# EasyEDA schematic SCH_OSHW_BiDi_SDI_Fiber_Converter_V4_Reclocker_2024-11-17.json

## Sheets
1 SFP: TITLE: Sheet_1; REV: 1.0; Date: 2024-08-29; Sheet: 1/1; Drawn By: TheStaticTurtle; Company: Your Company
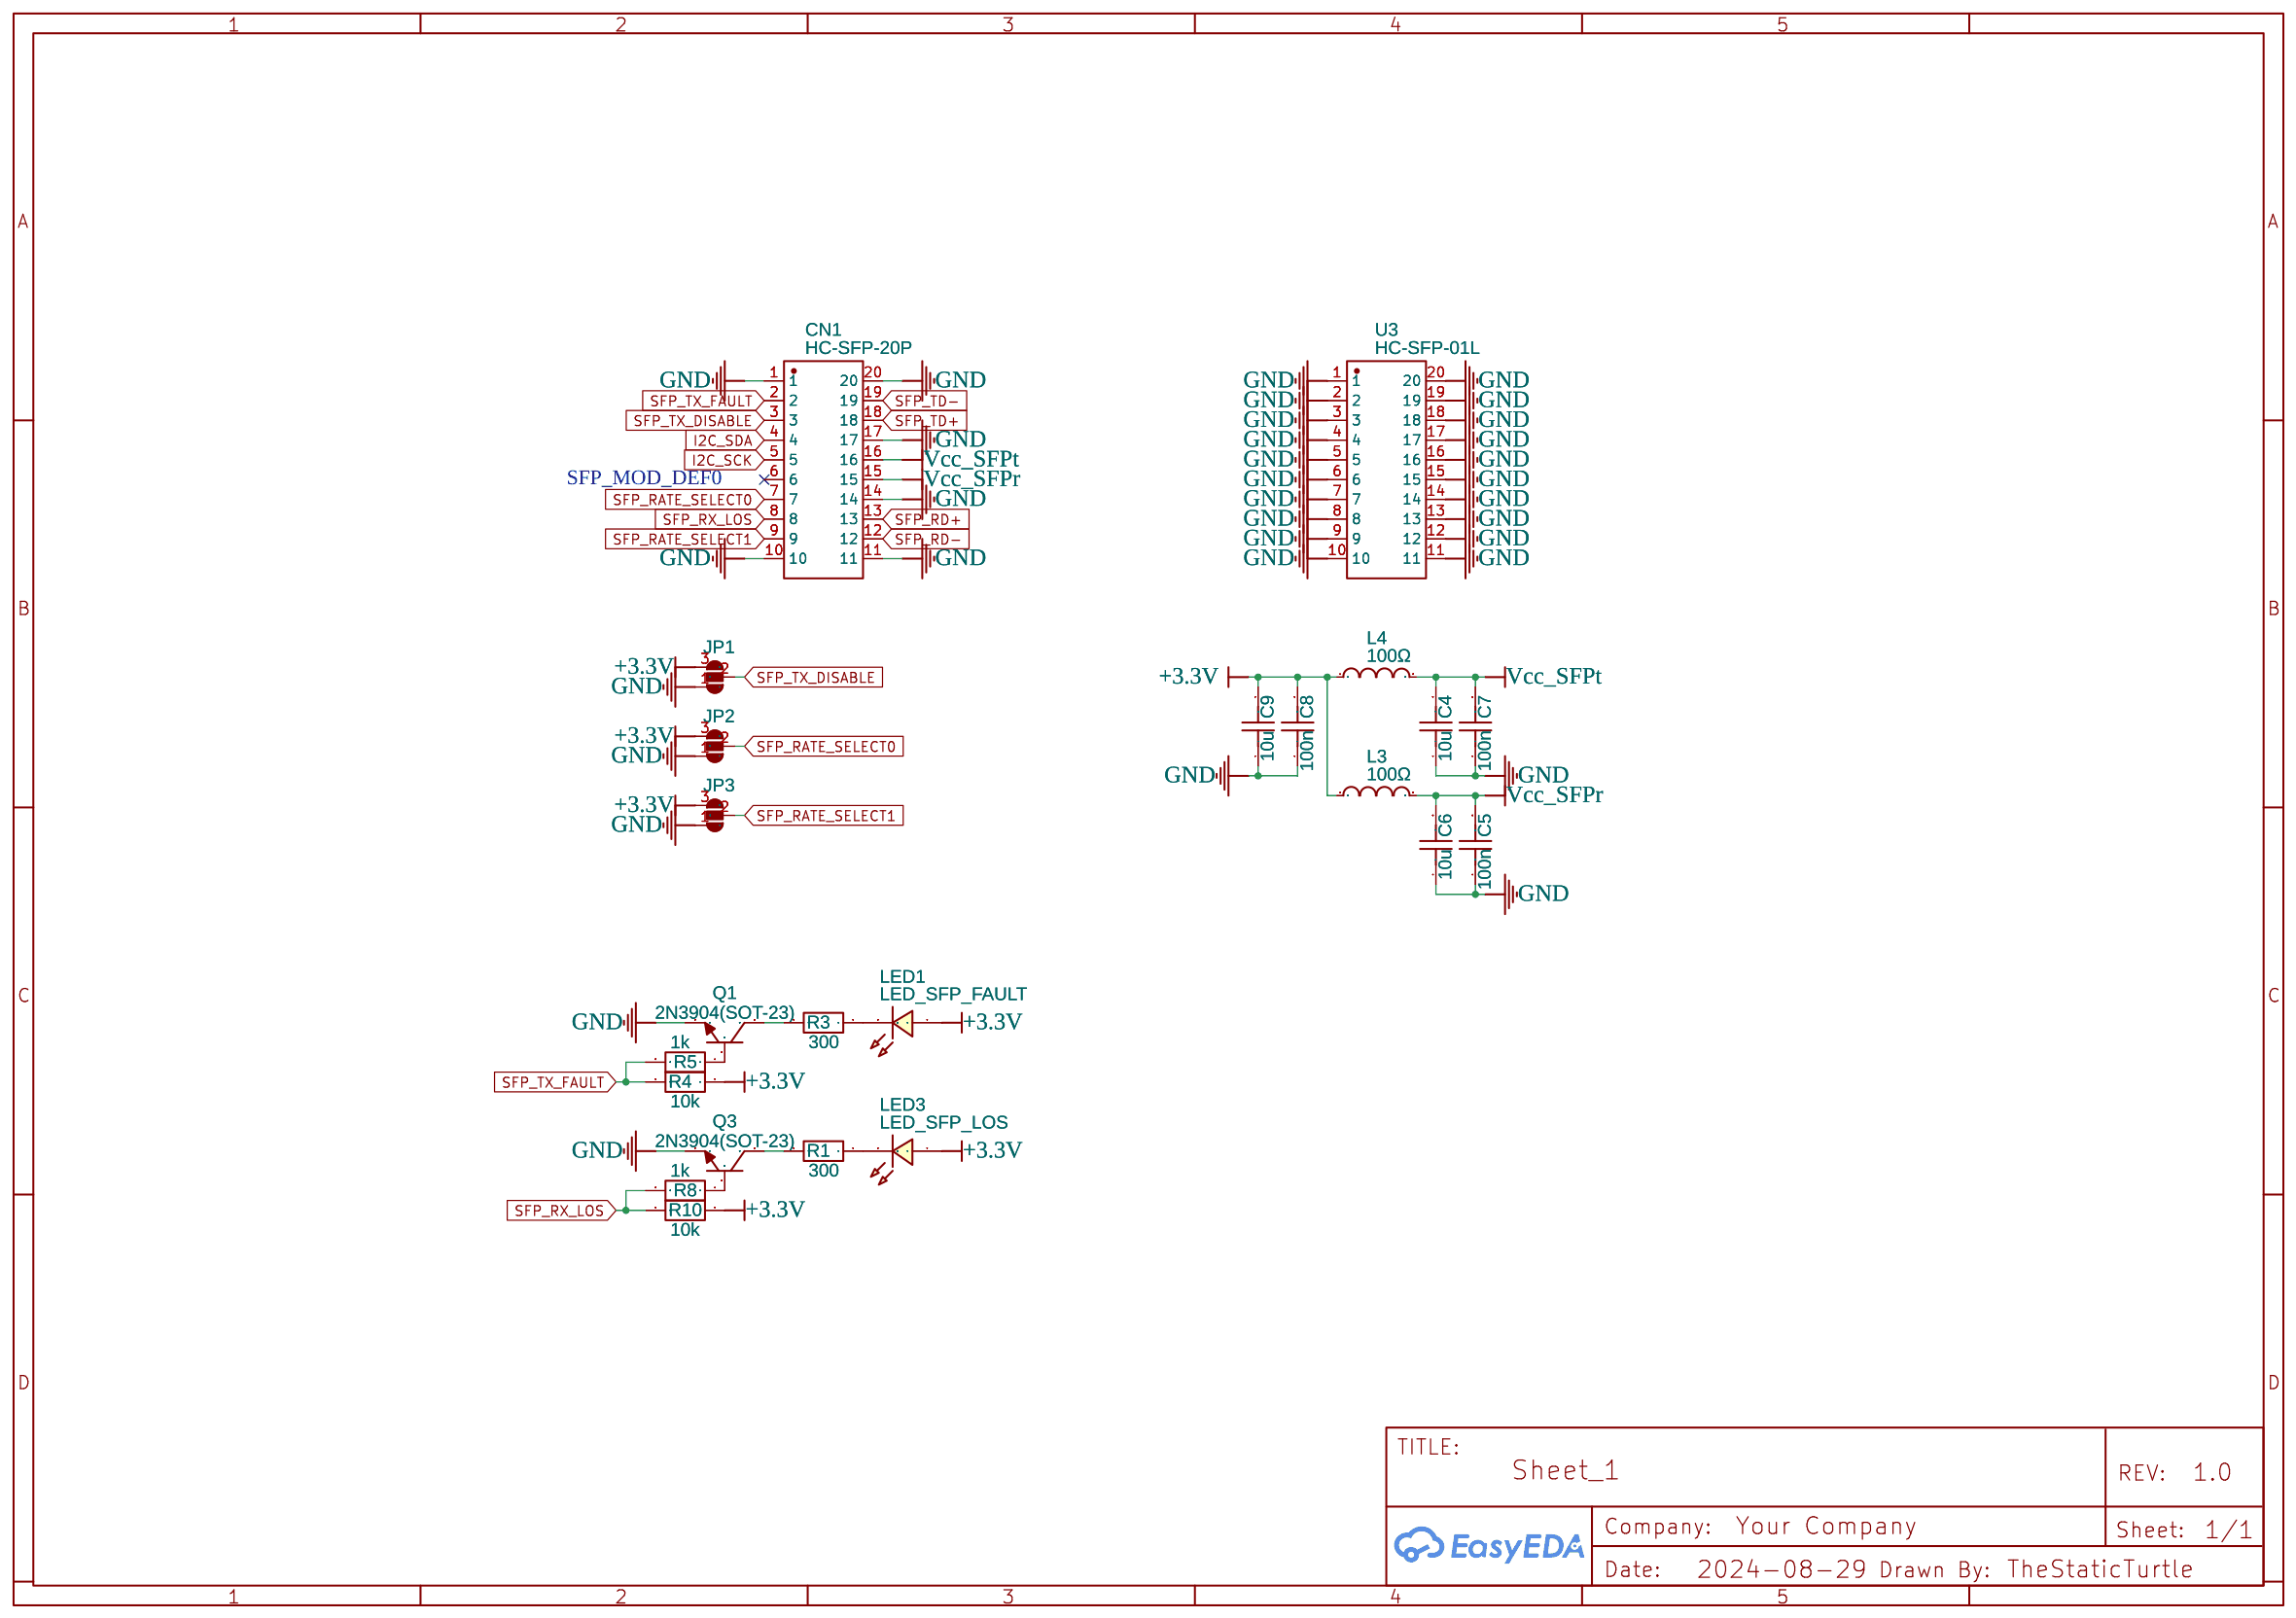
[diagram p0: SFP]
2 Power
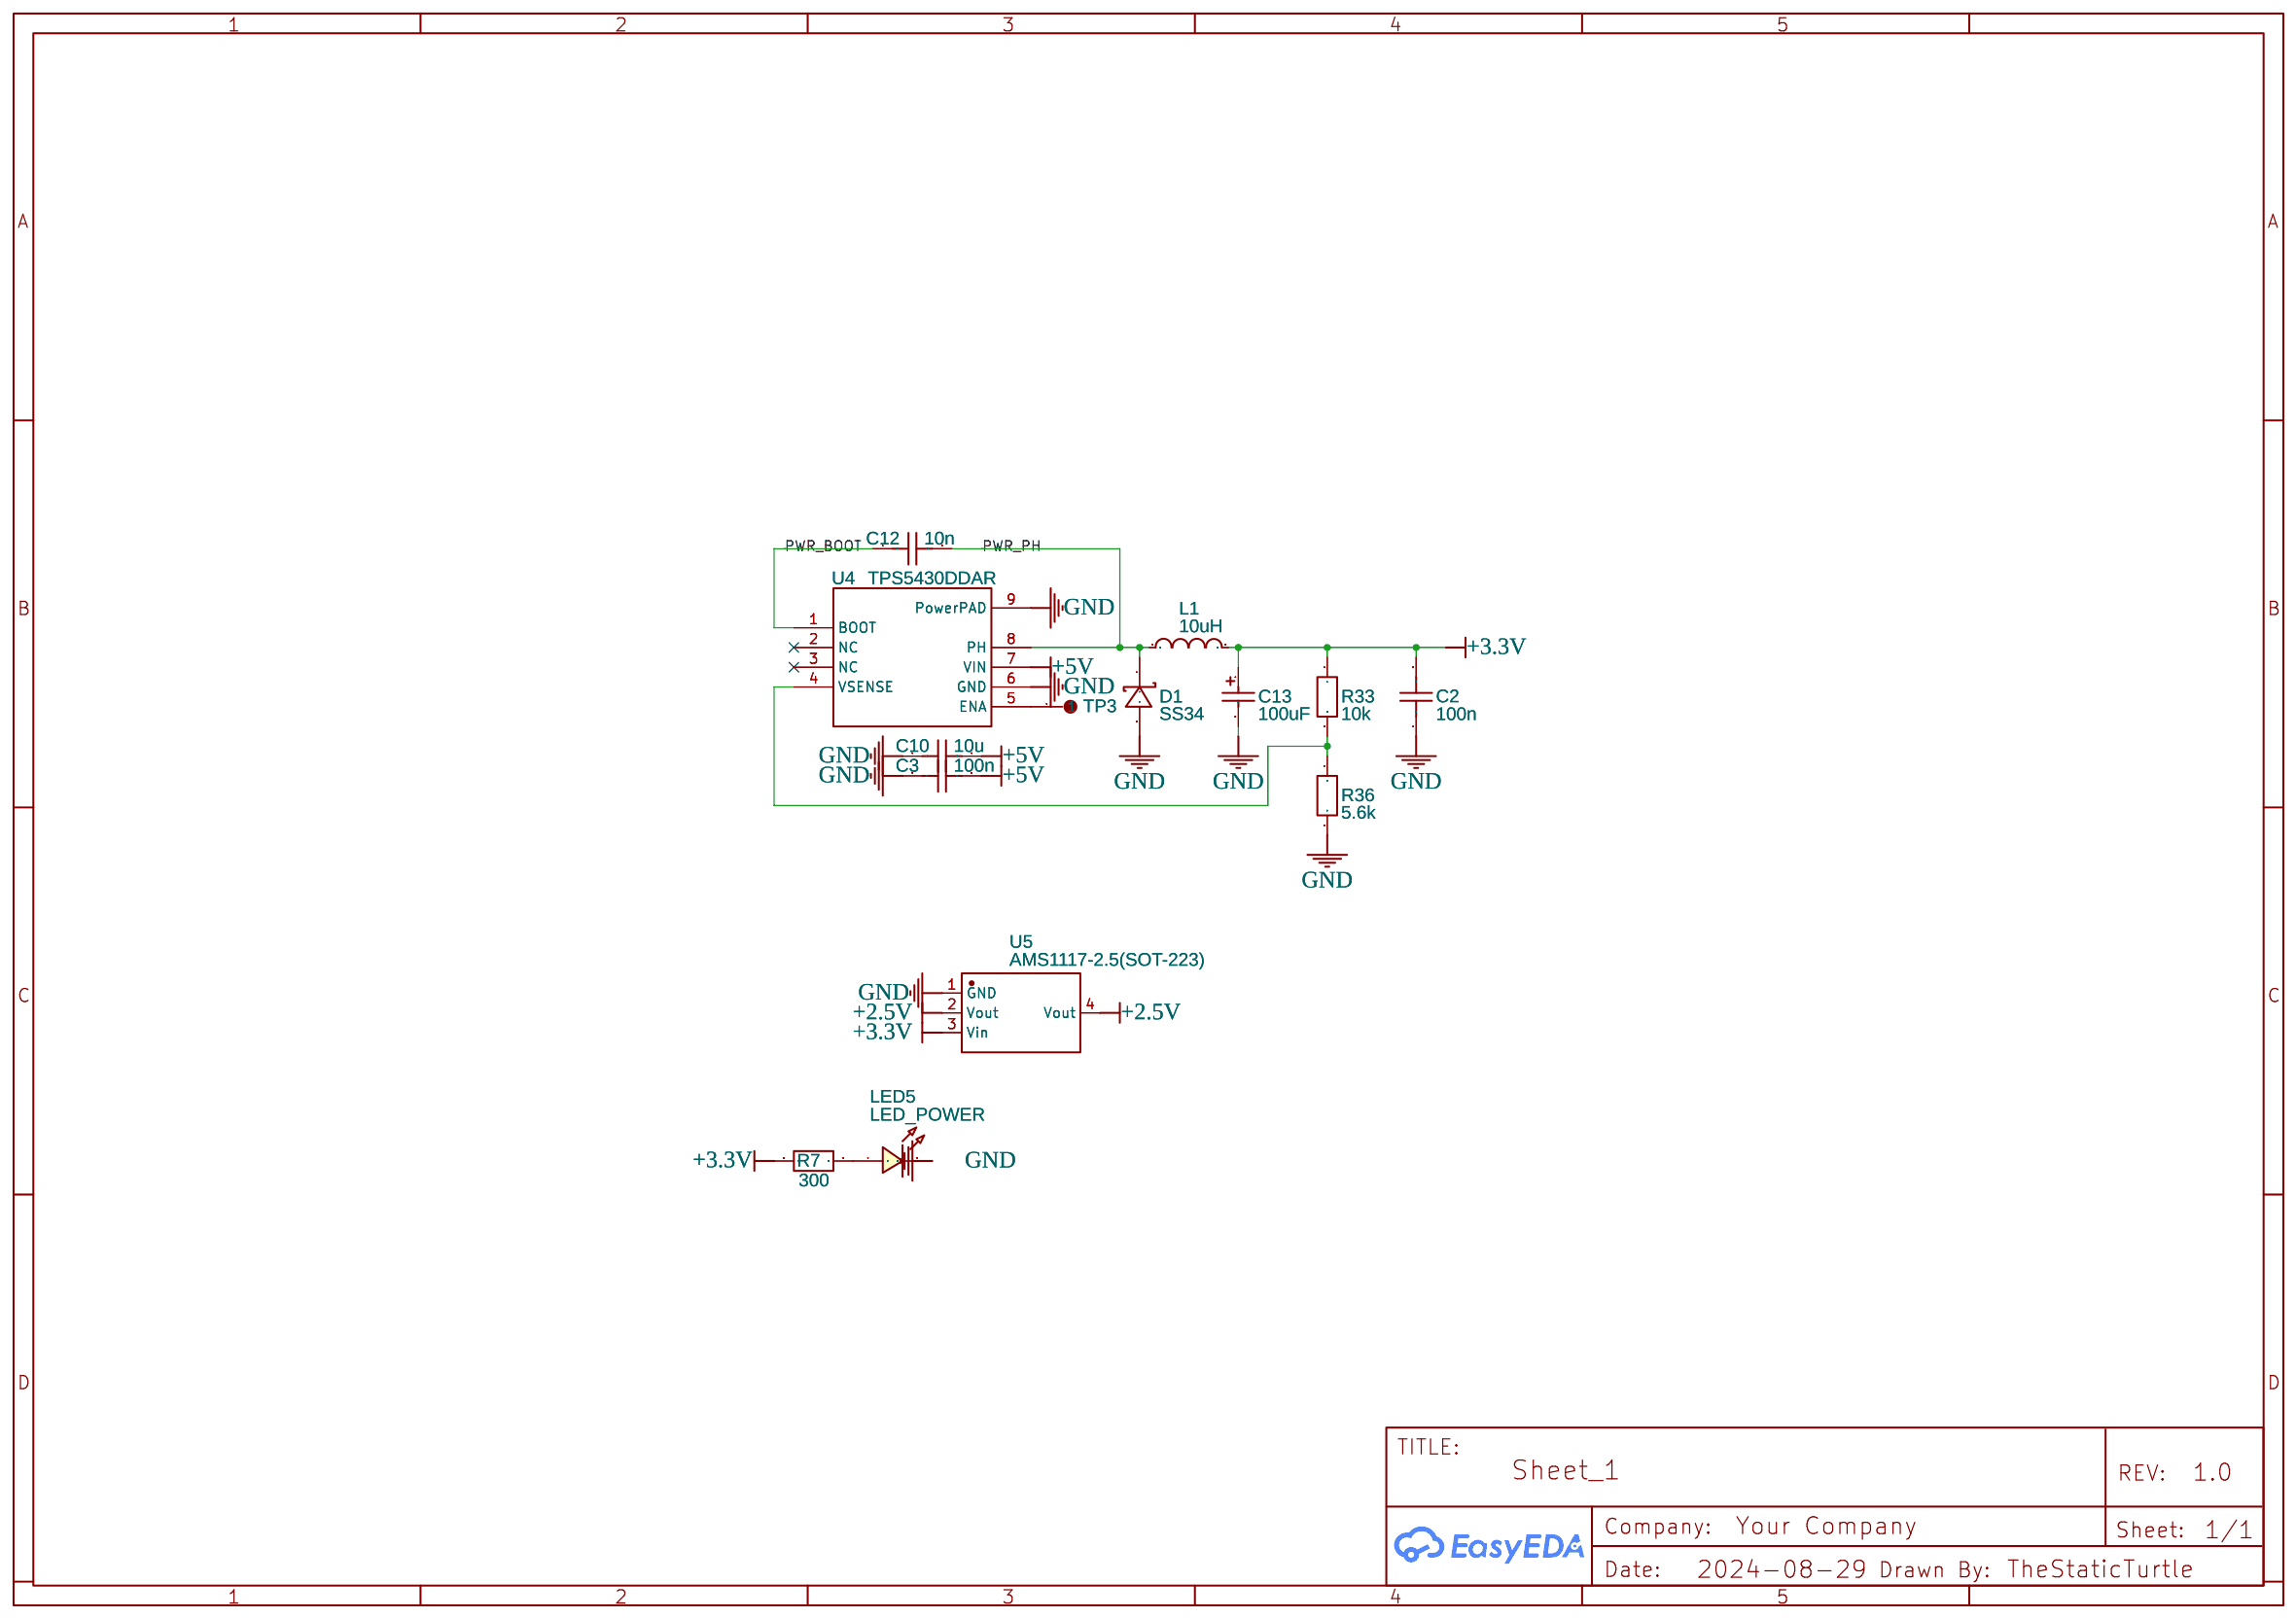
[diagram p1: Power]
3 SDI
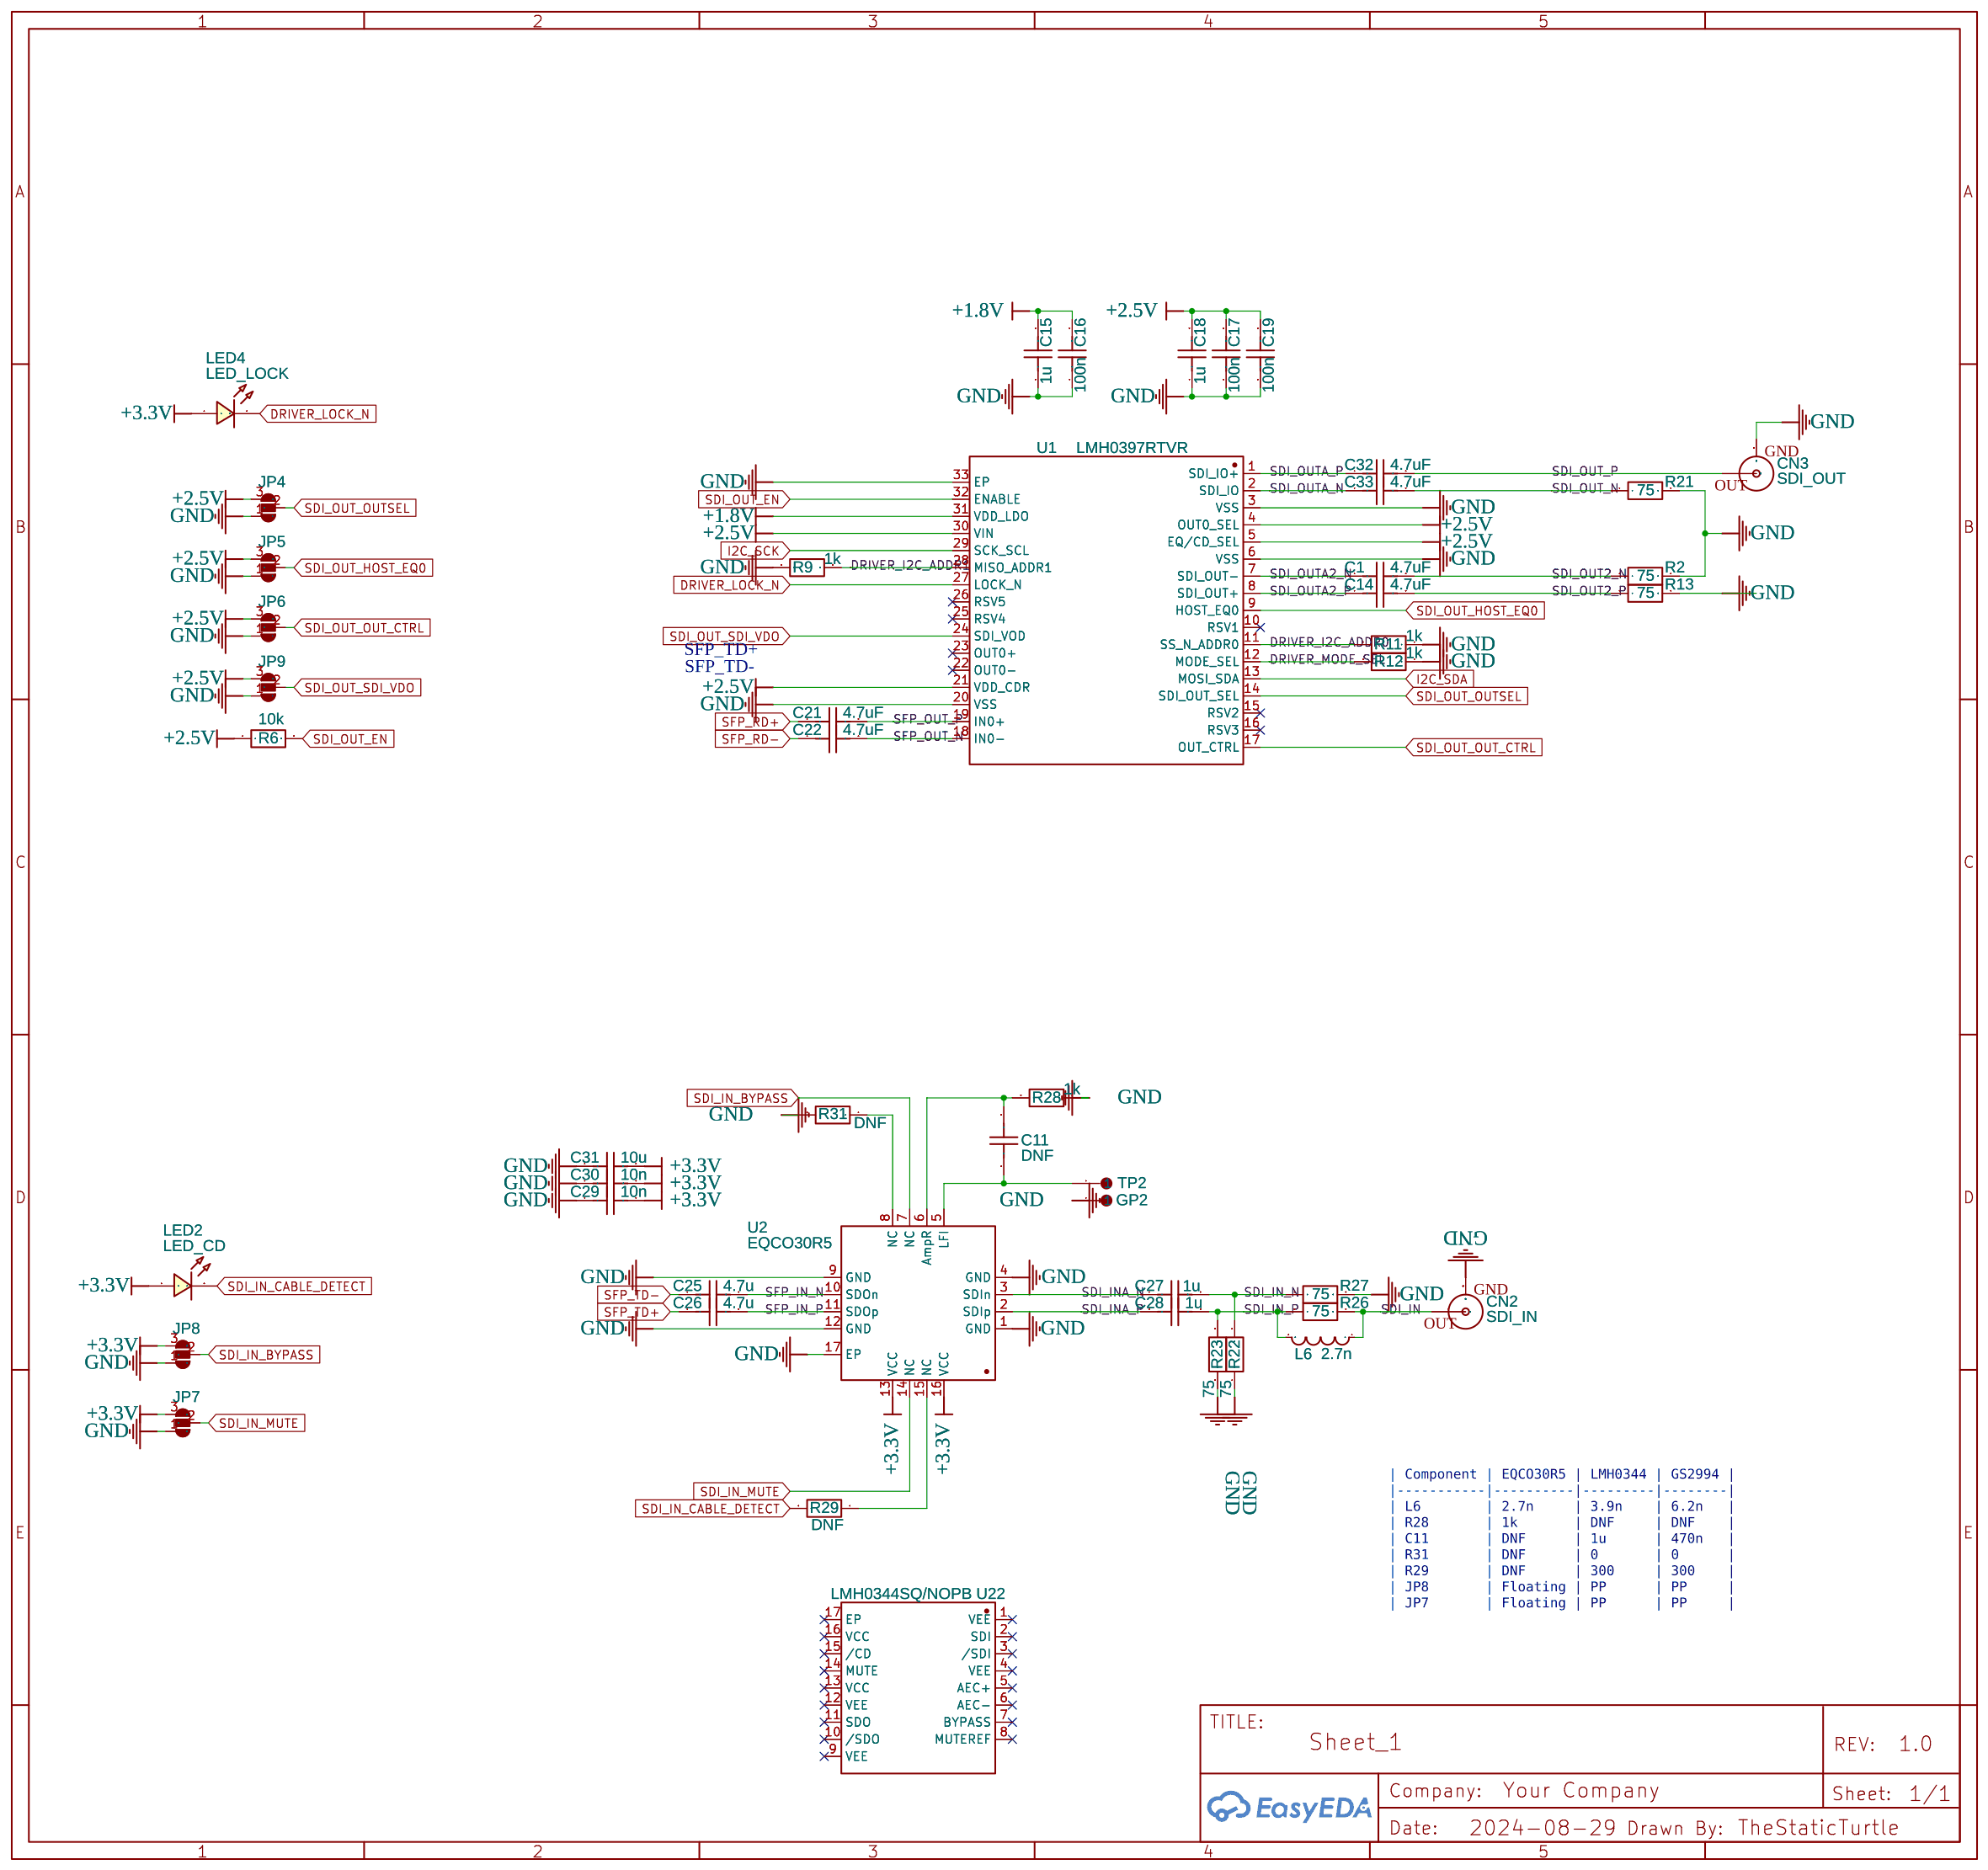
[diagram p2: SDI]
4 Diag: Date: 2024-09-08
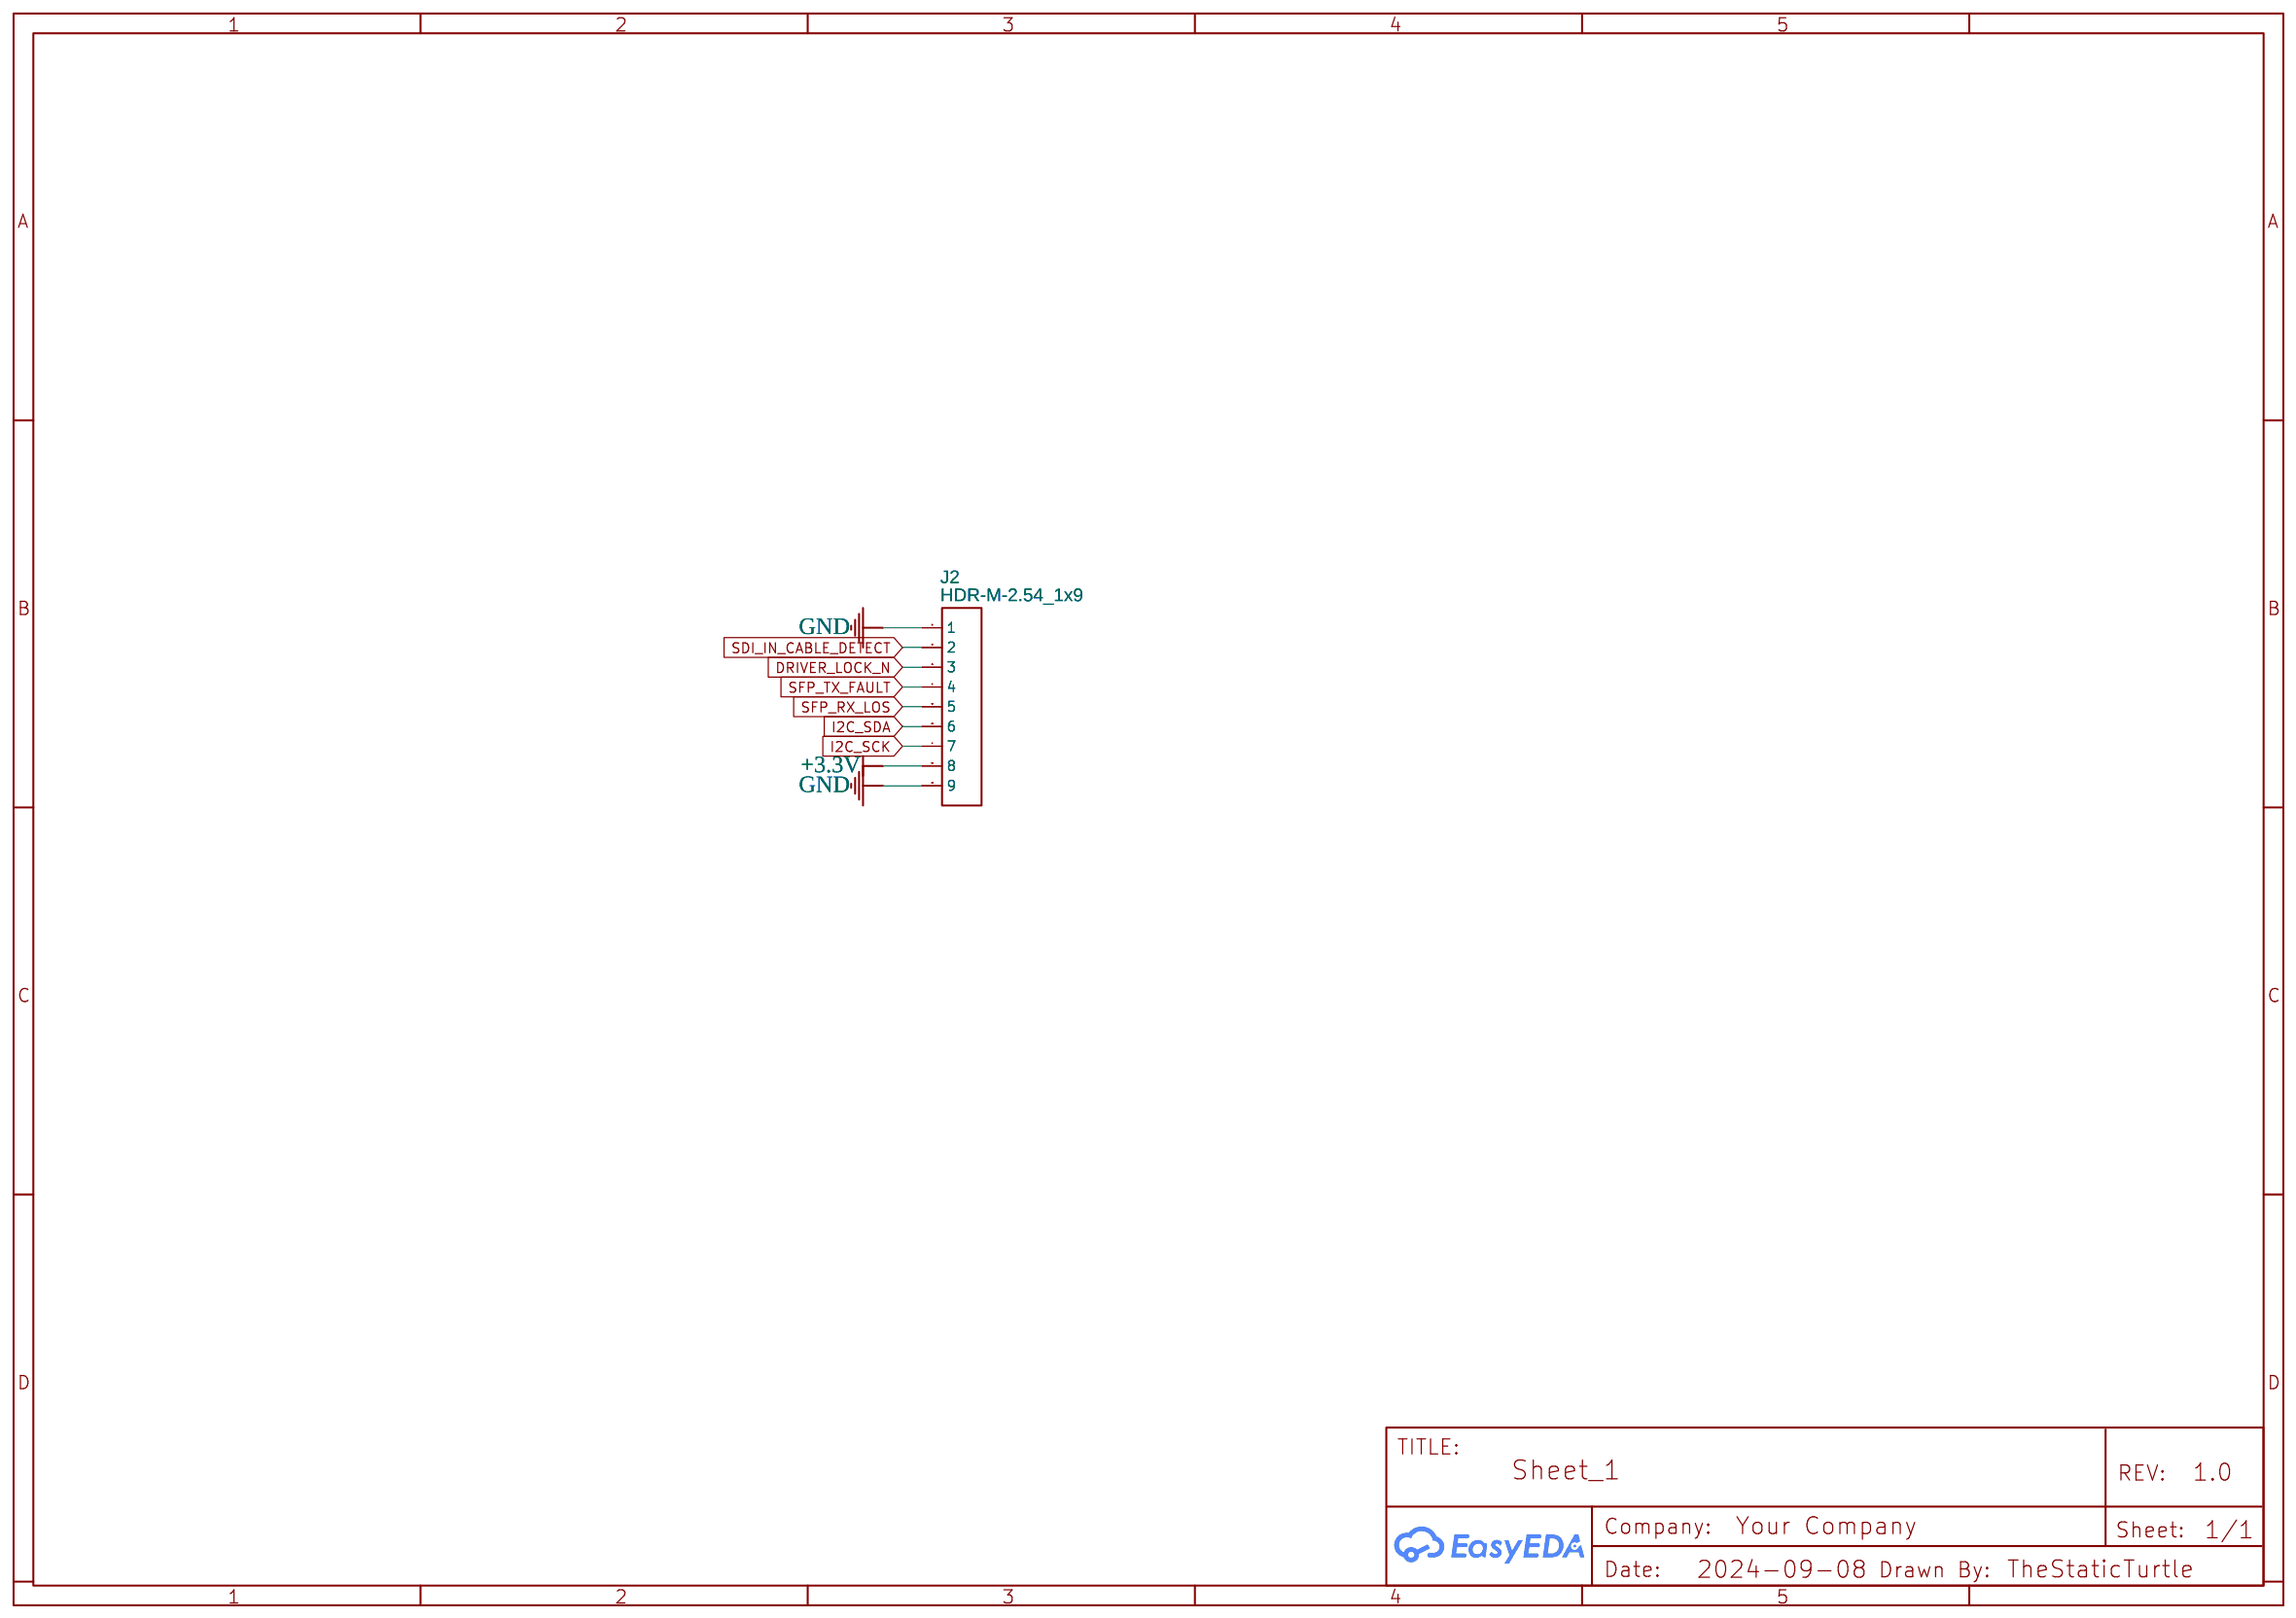
[diagram p3: Diag]

## Parts
sheet Diag
J2  HDR-M-2.54_1x9  [HDR-M-2.54_1X9]
sheet Power
C2  100n  [C0603]
C3  100n  [C0603]
C10  10u  [C0603]
C12  10n  [C0603]
C13  100uF  [CASE-B_3528]
D1  SS34  [SMA_L4.3-W2.6-LS5.2-RD]
L1  10uH  [IND-SMD_L4.0-W4.0]
LED5  LED_POWER  [LED0805_BLUE]
R7  300  [R0603]
R33  10k  [R0603]
R36  5.6k  [R0603]
TP3  TEST-POINT-PTH-1X1  [TESTPOINT-SMD_L1.6-W0.8_RCU-0C]
U4  TPS5430DDAR  [ESOP-8_L4.9-W3.9-P1.27-LS6.0-TL-EP]
U5  AMS1117-2.5(SOT-223)  [SOT-223-4_L6.5-W3.5-P2.30-LS7.0-BR]
sheet SDI
C1  4.7uF  [C0603]
C11  DNF  [C0603]
C14  4.7uF  [C0603]
C15  1u  [C0603]
C16  100n  [C0603]
C17  100n  [C0603]
C18  1u  [C0603]
C19  100n  [C0603]
C21  4.7uF  [C0603]
C22  4.7uF  [C0603]
C25  4.7u  [C0603]
C26  4.7u  [C0603]
C27  1u  [C0603]
C28  1u  [C0603]
C29  10n  [C0603]
C30  10n  [C0603]
C31  10u  [C0603]
C32  4.7uF  [C0603]
C33  4.7uF  [C0603]
CN2  SDI_IN  [AMPHENOLRF_034-1030-12G]
CN3  SDI_OUT  [AMPHENOLRF_034-1030-12G]
GP2  TEST-POINT-PTH-1X1  [TESTPOINT-SMD_L1.6-W0.8_RCU-0C]
JP4  SOLDER BRIDGE 3P  [SOLDER BRIDGE 3P]
JP5  SOLDER BRIDGE 3P  [SOLDER BRIDGE 3P]
JP6  SOLDER BRIDGE 3P  [SOLDER BRIDGE 3P]
JP7  SOLDER BRIDGE 3P  [SOLDER BRIDGE 3P]
JP8  SOLDER BRIDGE 3P  [SOLDER BRIDGE 3P]
JP9  SOLDER BRIDGE 3P  [SOLDER BRIDGE 3P]
L6  2.7n  [L0603]
LED2  LED_CD  [LED0805_GREEN]
LED4  LED_LOCK  [LED0805_GREEN]
R2  75  [R0603]
R6  10k  [R0603]
R9  1k  [R0603]
R11  1k  [R0603]
R12  1k  [R0603]
R13  75  [R0603]
R21  75  [R0603]
R22  75  [R0603]
R23  75  [R0603]
R26  75  [R0603]
R27  75  [R0603]
R28  1k  [R0603]
R29  DNF  [R0603]
R31  DNF  [R0603]
TP2  TEST-POINT-PTH-1X1  [TESTPOINT-SMD_L1.6-W0.8_RCU-0C]
U1  LMH0397RTVR  [QFN-32_L5.0-W5.0-P0.50-TL-EP3.5-1]
U2  EQCO30R5  [QFN16G-0.65-4X4MM]
U22  LMH0344SQ/NOPB  [QFN-16_L4.0-W4.0-P0.65-BL-EP2.6]
sheet SFP
C4  10u  [C0603]
C5  100n  [C0603]
C6  10u  [C0603]
C7  100n  [C0603]
C8  100n  [C0603]
C9  10u  [C0603]
CN1  HC-SFP-20P  [CONN-SMD_20P-P0.80_HCTL_HC-SFP-20P]
JP1  SOLDER BRIDGE 3P  [SOLDER BRIDGE 3P]
JP2  SOLDER BRIDGE 3P  [SOLDER BRIDGE 3P]
JP3  SOLDER BRIDGE 3P  [SOLDER BRIDGE 3P]
L3  100Ω  [L0805]
L4  100Ω  [L0805]
LED1  LED_SFP_FAULT  [LED0805_RED]
LED3  LED_SFP_LOS  [LED0805_RED]
Q1  2N3904(SOT-23)  [SOT-23-3_L2.9-W1.3-P1.90-LS2.4-TR]
Q3  2N3904(SOT-23)  [SOT-23-3_L2.9-W1.3-P1.90-LS2.4-TR]
R1  300  [R0603]
R3  300  [R0603]
R4  10k  [R0603]
R5  1k  [R0603]
R8  1k  [R0603]
R10  10k  [R0603]
U3  HC-SFP-01L  [TH_HC-SFP-01L]

## Library data of the parts
J2 = HDR-M-2.54_1x9: Supplier Part: C225484; Supplier: LCSC; Contributor: LCEDA_Lib
C1-C12 C14-C19 C21 C22 C25-C33 = C_0603_US: Contributor: LCEDA_Lib
C13 = TAJB107K006RNJ: Supplier: LCSC; Manufacturer: Kyocera AVX; Supplier Part: C16133; JLCPCB Part Class: Basic Part
D1 = SS34_C8678: Supplier: LCSC; Manufacturer: MDD(辰达半导体); Supplier Part: C8678
L1 = SWPA4030S100MT: Supplier: LCSC; Manufacturer: Sunlord(顺络); Supplier Part: C38117; JLCPCB Part Class: Extended Part
LED5 = LED-0805_B: Manufacturer: 方舟 ARKLED; Manufacturer Part: D-B080508B1-KS2; Supplier Part: C108412; Contributor: LCEDA_Lib
R1-R13 R21-R23 R26-R29 R31 R33 R36 = R_0603_EU: Contributor: LCEDA_Lib
GP2 TP2 TP3 = TEST-POINT-PTH-1X1
U4 = TPS5430DDAR: Supplier: LCSC; Manufacturer: TI(德州仪器); Supplier Part: C9864; JLCPCB Part Class: Basic Part
U5 = AMS1117-2.5(SOT-223): Contributor: lcsc; Supplier: LCSC; Supplier Part: C5346134; Manufacturer: HXY MOSFET(华轩阳电子); JLCPCB Part Class: Extended Part
CN2 CN3 = AMPHENOL RF - 034-1030-12G MINI BNC: Supplier Part: 523-34-1030-12G; Supplier: Mouser
JP1-JP9 = SOLDER BRIDGE 3P: Contributor: TheStaticTurtle
L6 = L0603_US: Contributor: LCEDA_Lib
LED2 LED4 = LED-0805_G: Manufacturer: 国星光电; Manufacturer Part: NCD0805G1; Supplier Part: C84260; Contributor: LCEDA_Lib
U1 = LMH0397RTVR: Contributor: LCSC; Supplier: LCSC; Supplier Part: C2652750; Manufacturer: TI(德州仪器); JLCPCB Part Class: Extended Part
U2 = EQCO30R5: Manufacturer: Microchip; link: https://www.microchip.com/en-us/product/eqco30r5; Contributor: turtleforgaming
U22 = LMH0344SQ/NOPB: Contributor: LCSC; Supplier: LCSC; Supplier Part: C191792; Manufacturer: TI(德州仪器); JLCPCB Part Class: Extended Part
CN1 = HC-SFP-20P: Contributor: LCSC; Supplier: LCSC; Supplier Part: C2897291; Manufacturer: HCTL(华灿天禄); JLCPCB Part Class: Extended Part
L3 L4 = GZ2012D101TF: Supplier: LCSC; Manufacturer: Sunlord(顺络); Supplier Part: C1015; JLCPCB Part Class: Basic Part
LED1 LED3 = LED-0805_R: Manufacturer: EVERLIGHT(台湾亿光); Manufacturer Part: 17-21SURC/S530-A3/TR8; Supplier Part: C72037; Contributor: LCEDA_Lib
Q1 Q3 = 2N3904(SOT-23): Supplier: LCSC; Manufacturer: KEC; Manufacturer Part: 2n3904S-RTK/PS; Supplier Part: C18536; Paste Type: SOT-23; Contributor: LCEDA_Lib
U3 = HC-SFP-01L: Contributor: LCSC; Supplier: LCSC; Supplier Part: C2897292; Manufacturer: HCTL(华灿天禄); JLCPCB Part Class: Extended Part

## Nets
+1.8V: C15.2 C16.2 U1.31(VDD_LDO)
+2.5V: C17.2 C18.2 C19.2 JP4.3(B) JP5.3(B) JP6.3(B) JP9.3(B) R6.1 U1.4(OUT0_SEL) U1.5(EQ/CD_SEL) U1.21(VDD_CDR) U1.30(VIN) U5.2(Vout) U5.4(Vout)
+3.3V: C2.2 C8.2 C9.2 C13.1 C29.2 C30.2 C31.2 J2.8 JP1.3(B) JP2.3(B) JP3.3(B) JP7.3(B) JP8.3(B) L1.2 L3.1 L4.1 LED1.1 LED2.1 LED3.1 LED4.1 R4.1 R7.2 R10.1 R33.1 U2.13(VCC) U2.16(VCC) U5.3(Vin)
+5V: C3.2 C10.2 U4.7(VIN)
GND: C2.1 C3.1 C4.1 C5.1 C6.1 C7.1 C8.1 C9.1 C10.1 C13.2 C15.1 C16.1 C17.1 C18.1 C19.1 C29.1 C30.1 C31.1 CN1.1 CN1.10 CN1.11 CN1.14 CN1.17 CN1.20 CN2.GND CN3.GND D1.2(A) GP2.1 J2.1 J2.9 JP1.1(A) JP2.1(A) JP3.1(A) JP4.1(A) JP5.1(A) JP6.1(A) JP7.1(A) JP8.1(A) JP9.1(A) LED5.2 Q1.1(E) Q3.1(E) R2.2 R9.2 R11.1 R12.1 R13.2 R21.2 R22.1 R23.1 R27.2 R28.1 R31.2 R36.2 U1.3(VSS) U1.6(VSS) U1.20(VSS) U1.33(EP) U2.1(GND) U2.4(GND) U2.9(GND) U2.12(GND) U2.17(EP) U3.1 U3.2 U3.3 U3.4 U3.5 U3.6 U3.7 U3.8 U3.9 U3.10 U3.11 U3.12 U3.13 U3.14 U3.15 U3.16 U3.17 U3.18 U3.19 U3.20 U4.6(GND) U4.9(PowerPAD) U5.1(GND)
Vcc_SFPr: C5.2 C6.2 CN1.15 L3.2
Vcc_SFPt: C4.2 C7.2 CN1.16 L4.2
DRIVER_I2C_ADDR0: R11.2 U1.11(SS_N_ADDR0)
DRIVER_I2C_ADDR1: R9.1 U1.28(MISO_ADDR1)
DRIVER_LOCK_N: J2.3 LED4.2 U1.27(LOCK_N)
DRIVER_MODE_SEL: R12.2 U1.12(MODE_SEL)
I2C_SCK: CN1.5 J2.7 U1.29(SCK_SCL)
I2C_SDA: CN1.4 J2.6 U1.13(MOSI_SDA)
PWR_BOOT: C12.1 U4.1(BOOT)
PWR_PH: C12.2 D1.1(K) L1.1 U4.8(PH)
SDI_IN: CN2.1(OUT) L6.1 R26.2
SDI_IN_BYPASS: JP8.2(B) U2.7(NC)
SDI_IN_CABLE_DETECT: J2.2 LED2.2 R29.2
SDI_IN_MUTE: JP7.2(B) U2.14(NC)
SDI_IN_N: C27.2 R22.2 R27.1
SDI_IN_P: C28.2 L6.2 R23.2 R26.1
SDI_INA_N: C27.1 U2.3(SDIn)
SDI_INA_P: C28.1 U2.2(SDIp)
SDI_OUT2_N: C1.2 R2.1
SDI_OUT2_P: C14.2 R13.1
SDI_OUT_EN: R6.2 U1.32(ENABLE)
SDI_OUT_HOST_EQ0: JP5.2(B) U1.9(HOST_EQ0)
SDI_OUT_N: C33.2 R21.1
SDI_OUT_OUT_CTRL: JP6.2(B) U1.17(OUT_CTRL)
SDI_OUT_OUTSEL: JP4.2(B) U1.14(SDI_OUT_SEL)
SDI_OUT_P: C32.2 CN3.1(OUT)
SDI_OUT_SDI_VDO: JP9.2(B) U1.24(SDI_VOD)
SDI_OUTA2_N: C1.1 U1.7(SDI_OUT-)
SDI_OUTA2_P: C14.1 U1.8(SDI_OUT+)
SDI_OUTA_N: C33.1 U1.2(SDI_IO)
SDI_OUTA_P: C32.1 U1.1(SDI_IO+)
SFP_IN_N: C25.2 U2.10(SDOn)
SFP_IN_P: C26.2 U2.11(SDOp)
SFP_OUT_N: C22.2 U1.18(IN0-)
SFP_OUT_P: C21.2 U1.19(IN0+)
SFP_RATE_SELECT0: CN1.7 JP2.2(B)
SFP_RATE_SELECT1: CN1.9 JP3.2(B)
SFP_RD+: C21.1 CN1.13
SFP_RD-: C22.1 CN1.12
SFP_RX_LOS: CN1.8 J2.5 R8.2 R10.2
SFP_TD+: C26.1 CN1.18
SFP_TD-: C25.1 CN1.19
SFP_TX_DISABLE: CN1.3 JP1.2(B)
SFP_TX_FAULT: CN1.2 J2.4 R4.2 R5.2
Net-(C11-1): C11.1 TP2.1 U2.5(LFI)
Net-(C11-2): C11.2 R28.2 U2.6(AmpR)
Net-(LED1-2): LED1.2 R3.1
Net-(LED3-2): LED3.2 R1.1
Net-(LED5-1): LED5.1 R7.1
Net-(Q1-2): Q1.2(B) R5.1
Net-(Q1-3): Q1.3(C) R3.2
Net-(Q3-2): Q3.2(B) R8.1
Net-(Q3-3): Q3.3(C) R1.2
Net-(R29-1): R29.1 U2.15(NC)
Net-(R31-1): R31.1 U2.8(NC)
Net-(R33-2): R33.2 R36.1 U4.4(VSENSE)
Net-(TP3-1): TP3.1 U4.5(ENA)

Not connected (* = marked no-connect by the designer): CN1 6*; U1 10(RSV1)* 15(RSV2)* 16(RSV3)* 22(OUT0-)* 23(OUT0+)* 25(RSV4)* 26(RSV5)*; U4 2(NC)* 3(NC)*; U22 1(VEE)* 2(SDI)* 3(/SDI)* 4(VEE)* 5(AEC+)* 6(AEC-)* 7(BYPASS)* 8(MUTEREF)* 9(VEE)* 10(/SDO)* 11(SDO)* 12(VEE)* 13(VCC)* 14(MUTE)* 15(/CD)* 16(VCC)* 17(EP)*

## Notes on the sheets
sheet 1
- SFP_MOD_DEF0
sheet 3
- SFP_TD+
- SFP_TD-
- | Component | EQCO30R5 | LMH0344 | GS2994 |
  |-----------|----------|---------|--------|
  | L6        | 2.7n     | 3.9n    | 6.2n   |
  | R28       | 1k       | DNF     | DNF    |
  | C11       | DNF      | 1u      | 470n   |
  | R31       | DNF      | 0       | 0      |
  | R29       | DNF      | 300     | 300    |
  | JP8       | Floating | PP      | PP     |
  | JP7       | Floating | PP      | PP     |
